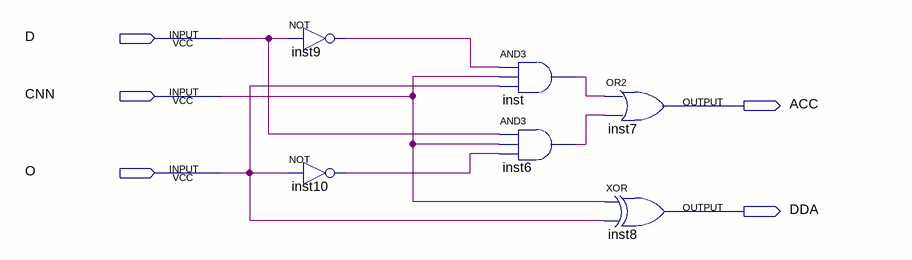
[diagram p0: schematic sheet]
// Quartus schematic HAS.bdf as structural Verilog: 6 symbols, 5 pins
module HAS (
  input  D,
  input  CNN,
  input  O,
  output ACC,
  output DDA
);

  wire inst6_out, inst9_out, inst10_out, inst_out;

  not inst9 (inst9_out, D);
  not inst10 (inst10_out, O);
  and inst (inst_out, inst9_out, CNN, O);
  and inst6 (inst6_out, D, CNN, inst10_out);
  or inst7 (ACC, inst_out, inst6_out);
  xor inst8 (DDA, CNN, O);
endmodule
